# Altium schematic sheet FPGA_ADC1.SchDoc
size A4
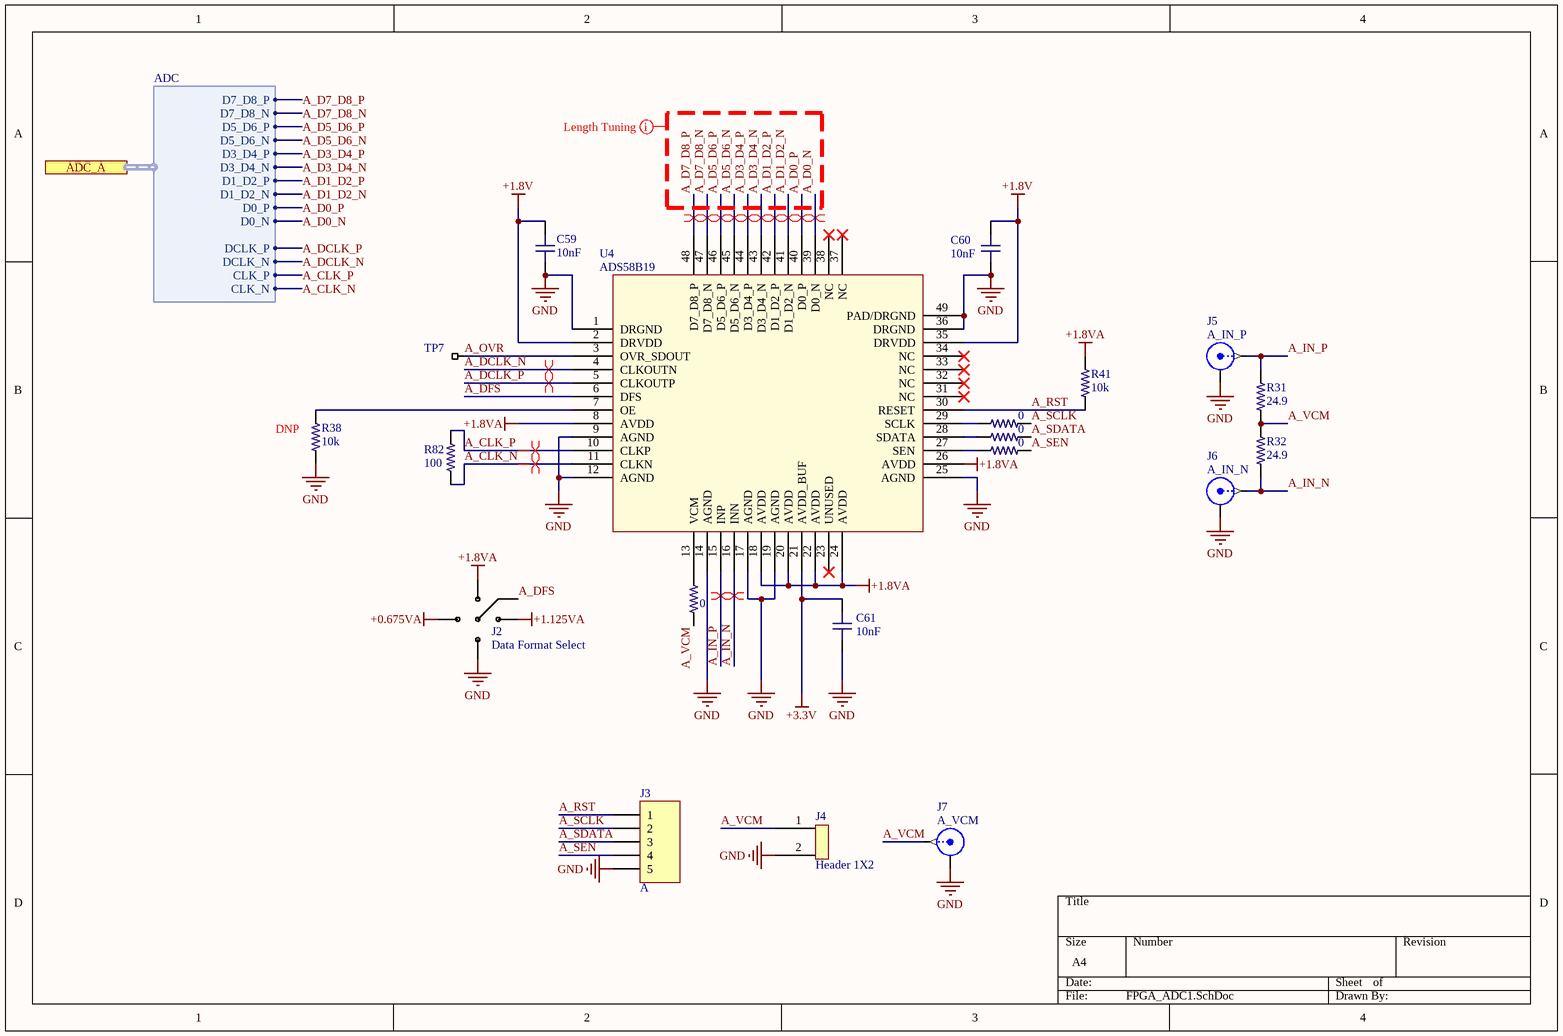
[diagram p0: FPGA_ADC1.SchDoc]

## Parts
C59  value 10nF  [C0603-HIGH-DENSITY]  (hidden comment: C0603 10nF 50V X7R)
C60  value 10nF  [C0603-HIGH-DENSITY]  (hidden comment: C0603 10nF 50V X7R)
C61  value 10nF  [C0603-HIGH-DENSITY]  (hidden comment: C0603 10nF 50V X7R)
J2  Data Format Select  [4P Jumper]
J3  A  [HDR1X5]
J4  Header 1X2  [Header 1x2 TH Pitch 2.54mm]
J5  A_IN_P  [SMA Edge Launch (Horizontal)]
J6  A_IN_N  [SMA Edge Launch (Horizontal)]
J7  A_VCM  [SMA_CONN]
R31  value 24.9  [R0603-HIGH-DENSITY]  (hidden comment: RC0603FR-0724R9L)
R32  value 24.9  [R0603-HIGH-DENSITY]  (hidden comment: RC0603FR-0724R9L)
R36  value 0  [R0603-IPC]  (hidden comment: R0603 0)
R37  value 0  [R0603-IPC]  (hidden comment: R0603 0)
R38  value 10k  [R0603-IPC-10K]  (hidden comment: R0603 10K 1%)
R39  value 0  [R0603-IPC]  (hidden comment: R0603 0)
R40  value 0  [R0603-IPC]  (hidden comment: R0603 0)
R41  value 10k  [R0603-IPC-10K]  (hidden comment: R0603 10K 1%)
R82  value 100  [R0402-HIGH-DENSITY]  (hidden comment: R0402 100R 1%)
TP7  Testpoint_SMT  [TESTPOINT_SMT]  (value not drawn)  (no BOM)
U4  ADS58B19  [VQFN48]

## Ports
ADC_A (harness ADC)

## Harnesses
ADC: D7_D8_P, D7_D8_N, D5_D6_P, D5_D6_N, D3_D4_P, D3_D4_N, D1_D2_P, D1_D2_N, D0_P, D0_N, CLK_P, CLK_N, DCLK_P, DCLK_N

## Nets
+0.675VA: J2.4
+1.8V: C59.1 C60.1 U4.2(DRVDD) U4.35(DRVDD)
+1.8VA: J2.1 R41.2 U4.8(AVDD) U4.18(AVDD) U4.20(AVDD) U4.22(AVDD) U4.24(AVDD) U4.26(AVDD)
+1.125VA: J2.2
+3.3V: C61.1 U4.21(AVDD_BUF)
GND: C59.2 C60.2 C61.2 J2.3 J3.5 J4.2 J5.2(Y) J6.2(Y) J7.G(Y) R38.1 U4.1(DRGND) U4.9(AGND) U4.12(AGND) U4.14(AGND) U4.17(AGND) U4.19(AGND) U4.25(AGND) U4.36(DRGND) U4.49(PAD/DRGND)
A_CLK_N: R82.1 U4.11(CLKN) ; port ADC_A.CLK_N
A_CLK_P: R82.2 U4.10(CLKP) ; port ADC_A.CLK_P
A_D0_N: U4.39(D0_N) ; port ADC_A.D0_N
A_D0_P: U4.40(D0_P) ; port ADC_A.D0_P
A_D1_D2_N: U4.41(D1_D2_N) ; port ADC_A.D1_D2_N
A_D1_D2_P: U4.42(D1_D2_P) ; port ADC_A.D1_D2_P
A_D3_D4_N: U4.43(D3_D4_N) ; port ADC_A.D3_D4_N
A_D3_D4_P: U4.44(D3_D4_P) ; port ADC_A.D3_D4_P
A_D5_D6_N: U4.45(D5_D6_N) ; port ADC_A.D5_D6_N
A_D5_D6_P: U4.46(D5_D6_P) ; port ADC_A.D5_D6_P
A_D7_D8_N: U4.47(D7_D8_N) ; port ADC_A.D7_D8_N
A_D7_D8_P: U4.48(D7_D8_P) ; port ADC_A.D7_D8_P
A_DCLK_N: U4.4(CLKOUTN) ; port ADC_A.DCLK_N
A_DCLK_P: U4.5(CLKOUTP) ; port ADC_A.DCLK_P
A_DFS: J2.5 U4.6(DFS)
A_IN_N: J6.1(X) R32.1 U4.16(INN)
A_IN_P: J5.1(X) R31.2 U4.15(INP)
A_OVR: TP7.1 U4.3(OVR_SDOUT)
A_RST: J3.1 R41.1 U4.30(RESET)
A_SCLK: J3.2 R36.2
A_SDATA: J3.3 R37.2
A_SEN: J3.4 R39.2
A_VCM: J4.1 J7.C(X) R31.1 R32.2 R40.2
NetR36_1: R36.1 U4.29(SCLK)
NetR37_1: R37.1 U4.28(SDATA)
NetR38_2: R38.2 U4.7(OE)
NetR39_1: R39.1 U4.27(SEN)
NetR40_1: R40.1 U4.13(VCM)

Not connected (* = marked no-connect by the designer): U4 23(UNUSED)* 31(NC)* 32(NC)* 33(NC)* 34(NC)* 37(NC)* 38(NC)*

## Layout directives
differential pair: A_D0_N, A_D0_P, A_D1_D2_N, A_D1_D2_P, A_D3_D4_N, A_D3_D4_P, A_D5_D6_N, A_D5_D6_P, A_D7_D8_N, A_D7_D8_P
differential pair; differential pair class AnalogIn: A_IN_N, A_IN_P
differential pair; differential pair class ADC_CLK: A_CLK_N, A_CLK_P, A_DCLK_N, A_DCLK_P
net class ADC_DATA - 150mil; net class ADC_DATA_A: A_D0_N, A_D0_P, A_D1_D2_N, A_D1_D2_P, A_D3_D4_N, A_D3_D4_P, A_D5_D6_N, A_D5_D6_P, A_D7_D8_N, A_D7_D8_P

## Notes on the sheet
- (near R38) DNP

## Library data of the parts
C59-C61 = C0603 10nF 50V X7R: CAP CER 10000PF 50V X7R 0603; EIA Code: X7R; Max. Voltage: 50V; Features: Soft Termination; Supplier 1: Digi-Key; Supplier Part Number 1: 490-10892-1-ND
J2 = 4P Jumper: 0603 4 Way Solder Jumper
J3 = Header 5: Header, 5-Pin; LatestRevisionDate: 17-Jul-2002; LatestRevisionNote: Re-released for DXP Platform.; Publisher: Altium Limited
J5-J7 = SMA: SMA Connector; Supplier 1: Digi-Key; Supplier Part Number 1: A97594-ND
R31 R32 = R0603 24.9R 1%: Chip Resistor, 0603, 24.9 ohms, 0.1W; Supplier 1: Digi-Key; Supplier 2: Mouser; Supplier Part Number 1: 311-24.9HRCT-ND; Supplier Part Number 2: 603-RC0603FR-0724R9L
R36 R37 R39 R40 = R0603 0: RES SMD 0 OHM JUMPER 1/10W 0603; Supplier 1: Digi-Key; Supplier Part Number 1: RMCF0603ZT0R00CT-ND
R38 R41 = R0603 10K 1%: RES SMD 10K OHM 1% 1/10W 0603; Supplier 1: Digi-Key; Supplier Part Number 1: RMCF0603FT10K0CT-ND
R82 = R0402 100R 1%: Chip Resistor, 0402, 100 ohms, 1%, 1/16 W; Supplier 1: Digi-Key; Supplier Part Number 1: 311-100LRCT-ND
TP7 = Testpoint_SMT: SMT Test Point
U4 = ADS58B19: Single ADC Pipelined 250Msps 9-bit Parallel/LVDS 48-Pin VQFN; Supplier 1: Digi-Key; Supplier 2: Mouser; Supplier Part Number 1: 296-28296-1-ND; Supplier Part Number 2: 595-ADS58B19IRGZT